# EAGLE schematic nRF9160 Thing Plus (EAGLE 9.6.2)
AUTHOR: Jared Wolff; BOARD_NUMBER: BRD-0016; COMPANY: Circuit Dojo; DOC_NUMBER: SCH-0016; DOC_REV: 1; PN: PS-NRF9160-THING-PLUS; TITLE: nRF9160 Thing Plus
Assembly variants: Production

## Sheet 1 of 3: Power + Headers
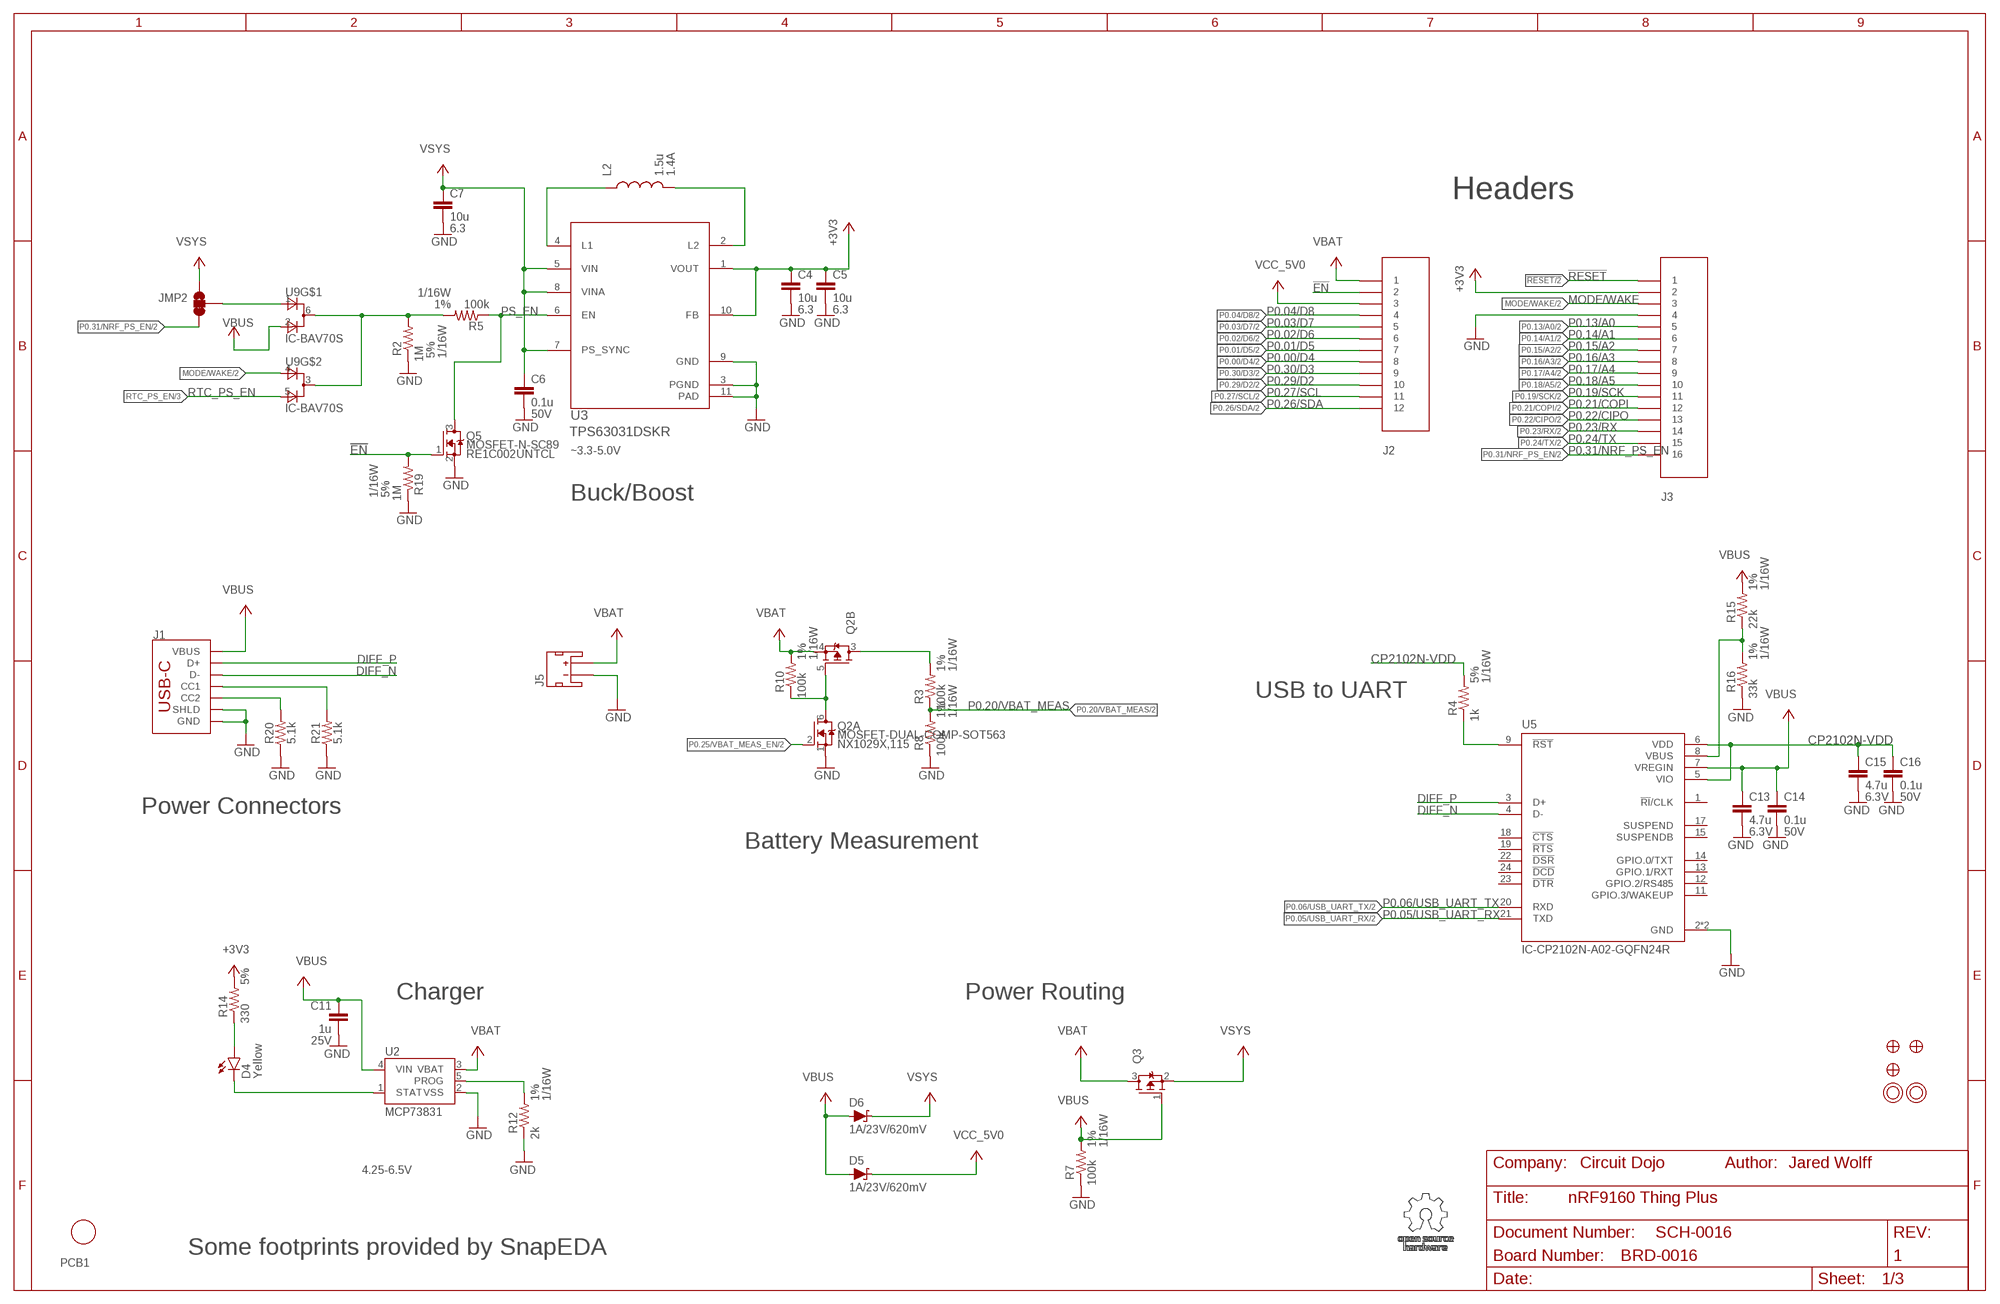
[diagram p0: schematic, sheet 1]

### Parts
C4  10u  CAP-10U-6.3V-0603  [C0603]
C5  10u  CAP-10U-6.3V-0603  [C0603]
C6  0.1u  CAP-0.1U-50V-0402  [CAPC1005X55N]
C7  10u  CAP-10U-6.3V-0603  [C0603]
C11  1u  CAP-1U-25V-1-0402  [CAPC1005X55N]
C13  4.7u  CAP-4.7U-6.3V-2-0603  [C0603]
C14  0.1u  CAP-0.1U-50V-0402  [CAPC1005X55N]
C15  4.7u  CAP-4.7U-6.3V-2-0603  [C0603]
C16  0.1u  CAP-0.1U-50V-0402  [CAPC1005X55N]
D4  Yellow  LED-YELLOW0603  [LED-0603]
D5  1A/23V/620mV  DIODE-SCHOTTKY-BAT20J  [SOD-323]
D6  1A/23V/620mV  DIODE-SCHOTTKY-BAT20J  [SOD-323]
J1  USB Female C  USB_C_2-LAYER_PADS  [USB-C-16P-2LAYER-PADS]
J2  CON-HEADER-1X12-MALE-PIN  [CON-HEADER-1X12-MALE-PIN]  (not fitted in variant Production)
J3  CON-HEADER-1X16-MALE-PIN  [CON-HEADER-1X16-MALE-PIN]  (not fitted in variant Production)
J5  JST_2MM_MALE  [JST-2-SMD]
JMP2  JUMPER-3/1  [JUMPER-ROUND-3-NO-R]
L2  1.5u  IND-1.5U-1.4A-2X2  [IND-2P0X2P0X1P2]
PCB1  PCB-NRF91-FEATHER  [PLACEHOLDER]
Q2  MOSFET-DUAL-COMP-SOT563  [SOT50P160X60-6N]
Q3  MOSFET-P-20V-4.7A-SOT23  [SOT23]
Q5  MOSFET-N-SC89  [DIO_RB558WMF-L]
R2  1M  RES-1M-5%-0402  [R0402-M]
R3  100k  RES-100K-1%-0402  [R0402-M]
R4  1k  RES-1K-5%-0402  [R0402-M]
R5  100k  RES-100K-1%-0402  [R0402-M]
R7  100k  RES-100K-1%-0402  [R0402-M]
R8  100k  RES-100K-1%-0402  [R0402-M]
R10  100k  RES-100K-1%-0402  [R0402-M]
R12  2k  RES-2K-1%-0402  [R0402-M]
R14  330  RES-330-5%-0402  [R0402-M]
R15  22k  RES-22K-1%-0402  [R0402-M]
R16  33k  RES-33K-1%-0402  [R0402-M]
R19  1M  RES-1M-5%-0402  [R0402-M]
R20  5.1k  5.1KOHM-0402T-1/16W-1%  [0402-TIGHT]
R21  5.1k  5.1KOHM-0402T-1/16W-1%  [0402-TIGHT]
U2  MCP73831  [SOT23-5]
U3  IC-TPS63031DSKR  [DSK0010A]
U5  IC-CP2102N-A02-GQFN24R  [QFN50P400X400X80-25N]
U9  IC-BAV70S  [SOT363]
U$3  FIDUCIAL-1MM  [FIDUCIAL-1MM]  (not fitted in variant Production)
U$4  FIDUCIAL-1MM  [FIDUCIAL-1MM]  (not fitted in variant Production)
U$31  MOUNTING-HOLE-2.5MM-PLATED  [MOUNTING-HOLE-2.5MM-PLATED]  (not fitted in variant Production)
U$32  MOUNTING-HOLE-2.5MM-PLATED  [MOUNTING-HOLE-2.5MM-PLATED]  (not fitted in variant Production)
U$35  FIDUCIAL-1MM  [FIDUCIAL-1MM]  (not fitted in variant Production)

### Nets
!EN: J2.2 Q5.1(G) R19.2
!RESET: J3.1 ; also sheet 2
+3V3: C4.1 C5.1 J3.2 R14.2 U3.1(VOUT) U3.10(FB) ; also sheet 2,3
CHRG: D4.C U2.1(STAT)
CP212_VBUS: R15.1 R16.2 U5.8(VBUS)
CP2102N-!RST: R4.1 U5.9(!RST)
CP2102N-VDD: C15.1 C16.1 R4.2 U5.5(VIO) U5.6(VDD)
DIFF_N [usb]: J1.A7(D-) J1.B7(D-) U5.4(D-)
DIFF_P [usb]: J1.A6(D+) J1.B6(D+) U5.3(D+)
GND: C4.2 C5.2 C6.2 C7.2 C11.2 C13.2 C14.2 C15.2 C16.2 J1.GND J1.GND2(GND) J1.SHLD1(SHLD) J1.SHLD2(SHLD) J1.SHLD3(SHLD) J1.SHLD4(SHLD) J3.4 J5.1(-) Q2.1(A:S) Q5.2(S) R2.1 R7.1 R8.1 R12.1 R16.1 R19.1 R20.1 R21.1 U2.2(VSS) U3.3(PGND) U3.9(GND) U3.11(PAD) U5.2(GND) U5.25(GND) ; also sheet 2,3
MODE/WAKE: J3.3 U9.4(A1) ; also sheet 2
N$1: L2.P$1 U3.4(L1)
N$2: L2.P$2 U3.2(L2)
N$3: J1.A5(CC1) R21.2
N$6: Q2.3(B:D) R3.2
N$7: Q2.5(B:G) Q2.6(A:D) R10.1
N$9: J1.B5(CC2) R20.2
N$13: D4.A R14.1
NRF_PS_EN_JMP: JMP2.P$2 U9.1(A1)
P0.00/D4: J2.8 ; also sheet 2
P0.01/D5: J2.7 ; also sheet 2
P0.02/D6: J2.6 ; also sheet 2
P0.03/D7: J2.5 ; also sheet 2
P0.04/D8: J2.4 ; also sheet 2
P0.05/USB_UART_RX: U5.21(TXD) ; also sheet 2
P0.06/USB_UART_TX: U5.20(RXD) ; also sheet 2
P0.13/A0: J3.5 ; also sheet 2
P0.14/A1: J3.6 ; also sheet 2
P0.15/A2: J3.7 ; also sheet 2
P0.16/A3: J3.8 ; also sheet 2
P0.17/A4: J3.9 ; also sheet 2
P0.18/A5: J3.10 ; also sheet 2
P0.19/SCK: J3.11 ; also sheet 2
P0.20/VBAT_MEAS: R3.1 R8.2 ; also sheet 2
P0.21/COPI: J3.12 ; also sheet 2
P0.22/CIPO: J3.13 ; also sheet 2
P0.23/RX: J3.14 ; also sheet 2
P0.24/TX: J3.15 ; also sheet 2
P0.25/VBAT_MEAS_EN: Q2.2(A:G) ; also sheet 2
P0.26/SDA: J2.12 ; also sheet 2,3
P0.27/SCL: J2.11 ; also sheet 2,3
P0.29/D2: J2.10 ; also sheet 2,3
P0.30/D3: J2.9 ; also sheet 2
P0.31/NRF_PS_EN: J3.16 JMP2.P$3 ; also sheet 2
PROG: R12.2 U2.5(PROG)
PS_EN: Q5.3(D) R5.1 U3.6(EN)
PS_EN_CC: R2.2 R5.2 U9.3(C) U9.6(C)
RTC_PS_EN: U9.5(A2) ; also sheet 3
VBAT: J2.1 J5.2(+) Q2.4(B:S) Q3.3(D) R10.2 U2.3(VBAT)
VBUS: C11.1 C13.1 C14.1 D5.A D6.A J1.VBUS1(VBUS) J1.VBUS2(VBUS) Q3.1(G) R7.2 R15.2 U2.4(VIN) U5.7(VREGIN) U9.2(A2)
VCC_5V0: D5.C J2.3
VSYS: C6.1 C7.1 D6.C JMP2.P$1 Q3.2(S) U3.5(VIN) U3.7(PS_SYNC) U3.8(VINA) ; also sheet 2,3
Unconnected: J5.NC1(PAD1) J5.NC2(PAD2) U5.1(!RI!/CLK) U5.11(GPIO.3/WAKEUP) U5.12(GPIO.2/RS485) U5.13(GPIO.1/RXT) U5.14(GPIO.0/TXT) U5.15(SUSPENDB) U5.17(SUSPEND) U5.18(!CTS) U5.19(!RTS) U5.22(!DSR) U5.23(!DTR) U5.24(!DCD)

### Notes on the sheet
- Headers
- ~3.3-5.0V
- Buck/Boost
- USB to UART
- Power Connectors
- Battery Measurement
- Charger | Power Routing
- 4.25-6.5V
- Some footprints provided by SnapEDA

## Sheet 2 of 3: Processor
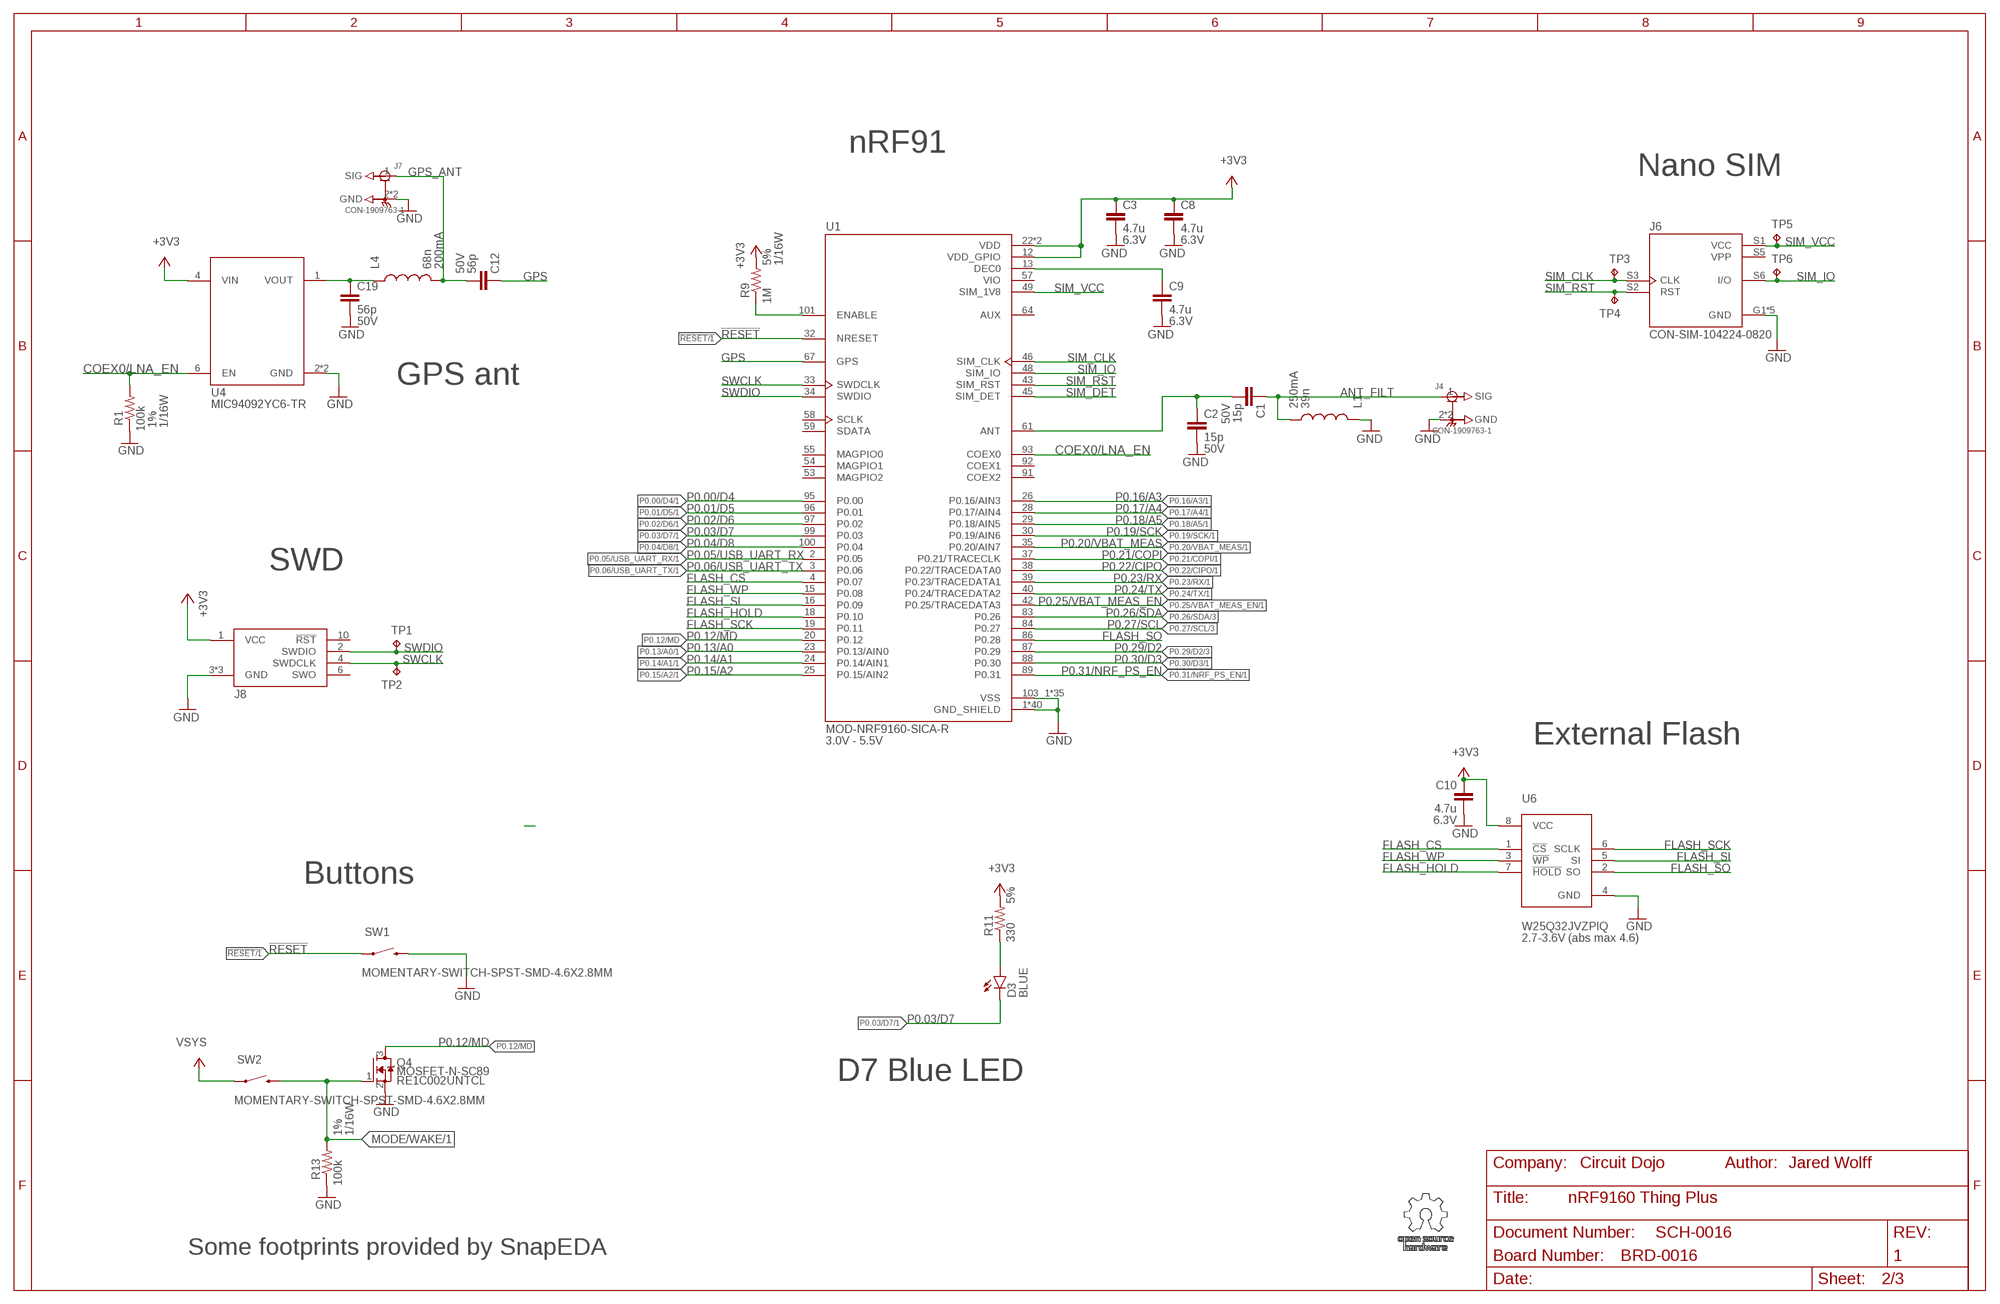
[diagram p1: schematic, sheet 2]

### Parts
C1  15p  CAP-15P-50V-0402  [CAPC1005X55N]
C2  15p  CAP-15P-50V-0402  [CAPC1005X55N]  (not fitted in variant Production)
C3  4.7u  CAP-4.7U-6.3V-2-0603  [C0603]
C8  4.7u  CAP-4.7U-6.3V-2-0603  [C0603]
C9  4.7u  CAP-4.7U-6.3V-2-0603  [C0603]
C10  4.7u  CAP-4.7U-6.3V-2-0603  [C0603]
C12  56p  CAP-56PF-50V-0402  [CAPC1005X55N]
C19  56p  CAP-56PF-50V-0402  [CAPC1005X55N]
D3  BLUE  LED-BLUE0603  [LED-0603]
J4  CON-1909763-1  [TE_1909763-1]
J6  CON-SIM-104224-0820  [MOLEX_104224-0820]
J7  CON-1909763-1  [TE_1909763-1]
J8  CON-FTSH-105-XX-X-DV  [SAMTEC_FTSH-105-XX-X-DV]
L1  39n  IND-39NH-250MA-0402  [IND0402_22N_TAI]
L4  68n  IND-68NH-200MA-0402  [IND0402_22N_TAI]
Q4  MOSFET-N-SC89  [DIO_RB558WMF-L]
R1  100k  RES-100K-1%-0402  [R0402-M]
R9  1M  RES-1M-5%-0402  [R0402-M]
R11  330  RES-330-5%-0402  [R0402-M]
R13  100k  RES-100K-1%-0402  [R0402-M]
SW1  MOMENTARY-SWITCH-SPST-SMD-4.6X2.8MM  [TACTILE_SWITCH_SMD_4.6X2.8MM]
SW2  MOMENTARY-SWITCH-SPST-SMD-4.6X2.8MM  [TACTILE_SWITCH_SMD_4.6X2.8MM]
TP1  TP-1SIDE-1P0  [TP-1P0]
TP2  TP-1SIDE-1P0  [TP-1P0]
TP3  TP-1SIDE-1P0  [TP-1P0]
TP4  TP-1SIDE-1P0  [TP-1P0]
TP5  TP-1SIDE-1P0  [TP-1P0]
TP6  TP-1SIDE-1P0  [TP-1P0]
U1  MOD-NRF9160-SICA-R  [NORDIC_NRF9160-SICA-R]
U4  POWER-SWITCH-MIC94092YC6  [SOT363]
U6  FLASH-WSON  FLASH-W25Q32JVZPIQ-WSON  [WIN_ZP-8-L]

### Nets
!RESET: SW1.1 SW1.2 U1.32(NRESET) ; also sheet 1
+3V3: C3.1 C8.1 C10.1 J8.1(VCC) R9.2 R11.2 U1.12(VDD_GPIO) U1.22(VDD) U1.102(VDD) U4.4(VIN) U6.8(VCC) ; also sheet 1,3
ANT [rf]: C1.2 C2.1 U1.61(ANT)
ANT_FILT [rf]: C1.1 J4.1(SIG) L1.2
COEX0/LNA_EN: R1.2 U1.93(COEX0) U4.6(EN)
FLASH_CS: U1.4(P0.07) U6.1(!CS)
FLASH_HOLD: U1.18(P0.10) U6.7(!HOLD)
FLASH_SCK: U1.19(P0.11) U6.6(SCLK)
FLASH_SI: U1.16(P0.09) U6.5(SI)
FLASH_SO: U1.86(P0.28) U6.2(SO)
FLASH_WP: U1.15(P0.08) U6.3(!WP)
GND: C2.2 C3.2 C8.2 C9.2 C10.2 C19.2 J4.2(GND) J4.3(GND) J6.G1(GND) J6.G2(GND) J6.G3(GND) J6.G4(GND) J6.S4(GND) J7.2(GND) J7.3(GND) J8.3(GND) J8.5(GND) J8.9(GND) L1.1 Q4.2(S) R1.1 R13.1 SW1.3 SW1.4 U1.1(GND_SHIELD) U1.5(GND_SHIELD) U1.6(GND_SHIELD) U1.7(GND_SHIELD) U1.8(GND_SHIELD) U1.9(GND_SHIELD) U1.11(GND_SHIELD) U1.14(GND_SHIELD) U1.17(GND_SHIELD) U1.21(GND_SHIELD) U1.27(GND_SHIELD) U1.31(GND_SHIELD) U1.36(GND_SHIELD) U1.41(GND_SHIELD) U1.44(GND_SHIELD) U1.47(GND_SHIELD) U1.50(GND_SHIELD) U1.52(GND_SHIELD) U1.56(GND_SHIELD) U1.60(GND_SHIELD) U1.62(GND_SHIELD) U1.63(GND_SHIELD) U1.65(GND_SHIELD) U1.66(GND_SHIELD) U1.68(GND_SHIELD) U1.69(GND_SHIELD) U1.72(GND_SHIELD) U1.74(GND_SHIELD) U1.75(GND_SHIELD) U1.76(GND_SHIELD) U1.77(GND_SHIELD) U1.78(GND_SHIELD) U1.79(GND_SHIELD) U1.80(GND_SHIELD) U1.81(GND_SHIELD) U1.82(GND_SHIELD) U1.85(GND_SHIELD) U1.90(GND_SHIELD) U1.94(GND_SHIELD) U1.98(GND_SHIELD) U1.103_1(VSS) U1.103_2(VSS) U1.103_3(VSS) U1.103_4(VSS) U1.103_5(VSS) U1.103_6(VSS) U1.103_7(VSS) U1.103_8(VSS) U1.103_9(VSS) U1.103_10(VSS) U1.103_11(VSS) U1.103_12(VSS) U1.103_13(VSS) U1.103_14(VSS) U1.103_15(VSS) U1.103_16(VSS) U1.103_17(VSS) U1.103_18(VSS) U1.103_19(VSS) U1.103_20(VSS) U1.103_21(VSS) U1.103_22(VSS) U1.103_23(VSS) U1.103_24(VSS) U1.103_25(VSS) U1.103_26(VSS) U1.103_27(VSS) U1.103_28(VSS) U1.103_29(VSS) U1.103_30(VSS) U1.103_31(VSS) U1.103_32(VSS) U1.103_33(VSS) U1.103_34(VSS) U1.103_35(VSS) U4.2(GND) U4.5(GND) U6.4(GND) ; also sheet 1,3
GPS [rf]: C12.1 U1.67(GPS)
GPS_ANT [rf]: C12.2 J7.1(SIG) L4.2
LNA_SW_OUT: C19.1 L4.1 U4.1(VOUT)
MODE/WAKE: Q4.1(G) R13.2 SW2.3 SW2.4 ; also sheet 1
N$4: R9.1 U1.101(ENABLE)
N$5: C9.1 U1.13(DEC0)
N$8: D3.A R11.1
P0.00/D4: U1.95(P0.00) ; also sheet 1
P0.01/D5: U1.96(P0.01) ; also sheet 1
P0.02/D6: U1.97(P0.02) ; also sheet 1
P0.03/D7: D3.C U1.99(P0.03) ; also sheet 1
P0.04/D8: U1.100(P0.04) ; also sheet 1
P0.05/USB_UART_RX: U1.2(P0.05) ; also sheet 1
P0.06/USB_UART_TX: U1.3(P0.06) ; also sheet 1
P0.12/MD: Q4.3(D) U1.20(P0.12)
P0.13/A0: U1.23(P0.13/AIN0) ; also sheet 1
P0.14/A1: U1.24(P0.14/AIN1) ; also sheet 1
P0.15/A2: U1.25(P0.15/AIN2) ; also sheet 1
P0.16/A3: U1.26(P0.16/AIN3) ; also sheet 1
P0.17/A4: U1.28(P0.17/AIN4) ; also sheet 1
P0.18/A5: U1.29(P0.18/AIN5) ; also sheet 1
P0.19/SCK: U1.30(P0.19/AIN6) ; also sheet 1
P0.20/VBAT_MEAS: U1.35(P0.20/AIN7) ; also sheet 1
P0.21/COPI: U1.37(P0.21/TRACECLK) ; also sheet 1
P0.22/CIPO: U1.38(P0.22/TRACEDATA0) ; also sheet 1
P0.23/RX: U1.39(P0.23/TRACEDATA1) ; also sheet 1
P0.24/TX: U1.40(P0.24/TRACEDATA2) ; also sheet 1
P0.25/VBAT_MEAS_EN: U1.42(P0.25/TRACEDATA3) ; also sheet 1
P0.26/SDA: U1.83(P0.26) ; also sheet 1,3
P0.27/SCL: U1.84(P0.27) ; also sheet 1,3
P0.29/D2: U1.87(P0.29) ; also sheet 1,3
P0.30/D3: U1.88(P0.30) ; also sheet 1
P0.31/NRF_PS_EN: U1.89(P0.31) ; also sheet 1
SIM_CLK: J6.S3(CLK) TP3.TP U1.46(SIM_CLK)
SIM_DET: U1.45(SIM_DET)
SIM_IO: J6.S6(I/O) TP6.TP U1.48(SIM_IO)
SIM_RST: J6.S2(RST) TP4.TP U1.43(SIM_RST)
SIM_VCC: J6.S1(VCC) TP5.TP U1.49(SIM_1V8)
SWCLK: J8.4(SWDCLK) TP2.TP U1.33(SWDCLK)
SWDIO: J8.2(SWDIO) TP1.TP U1.34(SWDIO)
VSYS: SW2.1 SW2.2 ; also sheet 1,3
Unconnected: J8.6(SWO) J8.10(!RST) U1.53(MAGPIO2) U1.54(MAGPIO1) U1.55(MAGPIO0) U1.58(SCLK) U1.59(SDATA) U1.64(AUX) U1.91(COEX2) U1.92(COEX1)

### Notes on the sheet
- nRF91
- Nano SIM
- GPS ant
- SWD
- 3.0V - 5.5V | External Flash
- Buttons
- 2.7-3.6V (abs max 4.6)
- D7 Blue LED
- Some footprints provided by SnapEDA

## Sheet 3 of 3: Wakeup Source & Qwiic
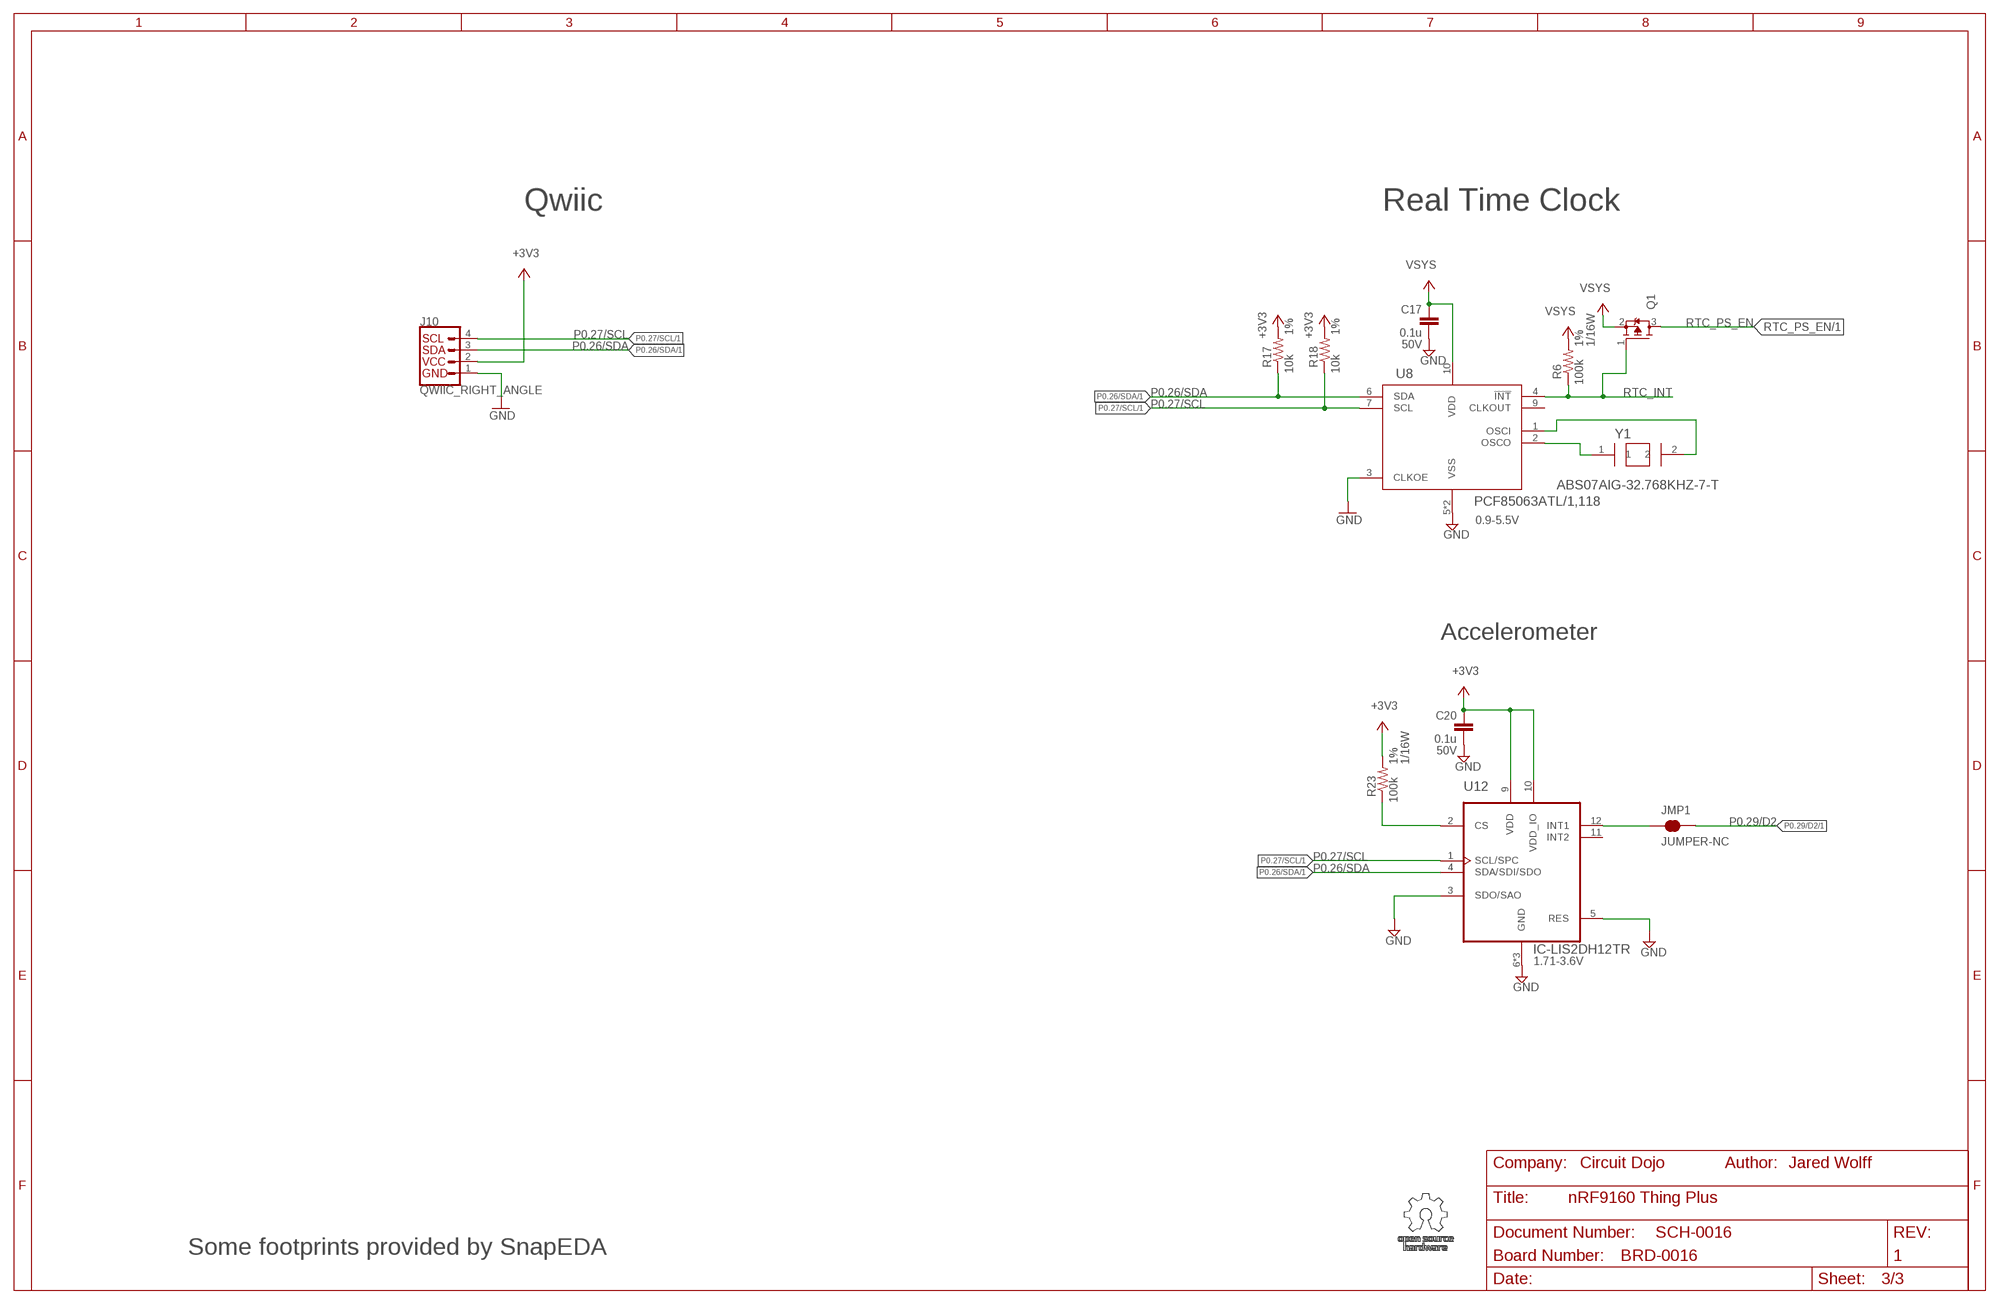
[diagram p2: schematic, sheet 3]

### Parts
C17  0.1u  CAP-0.1U-50V-0402  [CAPC1005X55N]
C20  0.1u  CAP-0.1U-50V-0402  [CAPC1005X55N]
J10  QWIIC_RIGHT_ANGLE  QWIIC_CONNECTORJS-1MM  [JST04_1MM_RA]
JMP1  JUMPER-NC  [JUMPER-ROUND-NC]
Q1  MOSFET-P-SC89  [DIO_RB558WMF-L]
R6  100k  RES-100K-1%-0402  [R0402-M]
R17  10k  RES-10K-1%-0402  [R0402-M]
R18  10k  RES-10K-1%-0402  [R0402-M]
R23  100k  RES-100K-1%-0402  [R0402-M]
U8  IC-PCF85063ATL/1  [DFN10_2P7X2P7-L]
U12  IC-LIS2DH12TR  [PQFN50P200X200100-12N]
Y1  XTAL-ABS07AIG-32.768KHZ-7-T  [XTAL320X150X90]

### Nets
+3V3: C20.1 J10.2 R17.2 R18.2 R23.2 U12.9(VDD) U12.10(VDD_IO) ; also sheet 1,2
GND: C17.2 C20.2 J10.1 U8.3(CLKOE) U8.5(VSS) U8.11(VSS) U12.3(SDO/SAO) U12.5(RES) U12.6(GND) U12.7(GND) U12.8(GND) ; also sheet 1,2
N$10: U8.1(OSCI) Y1.2
N$11: R23.1 U12.2(CS)
N$12: JMP1.P$1 U12.12(INT1)
N$18: U8.2(OSCO) Y1.1
P0.26/SDA: J10.3 R17.1 U8.6(SDA) U12.4(SDA/SDI/SDO) ; also sheet 1,2
P0.27/SCL: J10.4 R18.1 U8.7(SCL) U12.1(SCL/SPC) ; also sheet 1,2
P0.29/D2: JMP1.P$2 ; also sheet 1,2
RTC_INT: Q1.1(G) R6.1 U8.4(!INT)
RTC_PS_EN: Q1.3(D) ; also sheet 1
VSYS: C17.1 Q1.2(S) R6.2 U8.10(VDD) ; also sheet 1,2
Unconnected: U8.9(CLKOUT) U12.11(INT2)

### Notes on the sheet
- Qwiic | Real Time Clock
- 0.9-5.5V
- Accelerometer
- 1.71-3.6V
- Some footprints provided by SnapEDA

## Power pins joined to a net without a drawn wire
VIO: U1.57(VIO)
VPP: J6.S5(VPP)

## Library data of the parts
C1 C2 = nRF9160-Capacitors:CAP: CAPACITOR; DESC: CAP CER 15PF 50V C0G/NPO 0402; DIGIKEYPN: 311-1017-1-ND; MF: Yageo; MPN: CC0402JRNPO9BN150; PROD_ID: CAP-13063; VOLTHIGH: 50V
C3 C8-C10 C13 C15 = nRF9160-Capacitors:CAP: CAPACITOR; DESC: CAP CER 4.7UF 6.3V X7R 0603; DIGIKEYPN: 587-4906-1-ND; MPN: JMK107BB7475MA-T; PROD_ID: CAP-08280; TEMPHIGH: 125; TEMPLOW: -55; VOLTHIGH: 6.3V
C4 C5 C7 = nRF9160-Capacitors:CAP: CAPACITOR; DESC: CAP CER 10UF 6.3V X5R 0603; DIGIKEYPN: 587-5869-1-ND; MPN: JMK107ABJ106MA-T; PROD_ID: CAP-11015; VOLTHIGH: 6.3
C6 C14 C16 C17 C20 = nRF9160-Capacitors:CAP: CAPACITOR; DESC: CAP CER 0.1UF 50V X5R 0402; DIGIKEYPN: 587-3499-1-ND; MF: Taiyo Yuden; MPN: UMK105BJ104KV-F; PROD_ID: CAP-15083; VOLTHIGH: 50V
C11 = nRF9160-Capacitors:CAP: CAPACITOR; DESC: CAP CER 1UF 25V X5R 0402; DIGIKEYPN: 445-9081-1-ND; MF: TDK; MPN: C1005X5R1E105M050BC; PROD_ID: CAP-12417; VOLTHIGH: 25V
C12 C19 = nRF9160-Capacitors:CAP: CAPACITOR; DESC: CAP CER 56PF 50V C0G/NP0 0402; DIGIKEYPN: 399-1020-1-ND‎; MF: Kemet; MPN: C0402C560J5GACTU‎; PROD_ID: CAP-15409; VOLTHIGH: 50V
D3 = SparkFun-LED:LED-BLUE: Blue SMD LED Used in manufacturing of various products at SparkFun Packages: 0603 - SMD 0603 package [Product Link] <http://www.digikey.com/product-detail/en/SMLE12BC7TT86/511-1589-2-ND/1641808> 1206 - SMD1206 package [Product Link] <http://www.digikey.com/product-detail/en/lite-on-inc/LTST-C150TBKT/160-1643-1-ND/573584> SparkFun Products: ESP8266 Thing-Dev Board <https://www.sparkfun.com/products/13711> RedBoard <https://www.sparkfun.com/products/12757>; PROD_ID: DIO-08575
D4 = SparkFun-LED:LED-YELLOW: Yellow SMD LED Used in manufacturing several products at SparkFun. Packages: 0603 - SMD 0603 package[Product Link] <http://www.kingbrightusa.com/product.asp?catalog_name=LED&product_id=APT1608SYCK> 0603 -SMART - SMART SMD 0603 package (more efficient/more expensive) [Product Link] <http://www.osram-os.com/osram_os/en/products/product-catalog/led-light-emitting-diodes/smartled-0603/ly-l29k/index.jsp> LilyPad - SMD1206 package[Product Datasheet] <https://www.sparkfun.com/datasheets/DevTools/LilyPad/Q150YUS4.pdf> SparkFun Products: Blynk Board <https://www.sparkfun.com/products/13794> IOIO-OTG <https://www.sparkfun.com/products/13613> XBee Explorer Serial <https://www.sparkfun.com/products/13225>; PROD_ID: DIO-09003
D5 D6 = SparkFun-DiscreteSemi:DIODE-SCHOTTKY: Schottky diode A Schottky diode is a semiconductor diode which has a low forward voltage drop and a very fast switching action.; PROD_ID: DIO-11623
J1 = SparkFun-Connectors:USB_C: USB Type C 16Pin Connector Super Speed pins not available on the 16-pin purely SMD connector so this part is best for USB 2.0 implementations. D1 and D2 are tied together enabling D+/- no matter which way the cable is plugged into the connector. The two channel configuration pins (CC1/2) are exposed. These are normally connected to ground via 5.1k resistors but can be reconfigured for high current/high power applications.; PROD_ID: CONN-14122
J2 = wolff-den:CON-HEADER-1X12; ALIAS: POGO-1.9MM-S19-501
J3 = wolff-den:CON-HEADER-1X16
J4 J7 = nRF9160-Connectors:CON-1909763-1: VAO ITEM, MINI RF HEADER; DESC: CONN UMCC JACK STR 50OHM SMD; DIGIKEYPN: A118077CT-ND; MF: TE Connectivity; MPN: 1909763-1; PROD_ID: CONN-15410
J5 = SparkFun-Connectors:JST_2MM_MALE: JST 2MM MALE RA CONNECTOR Two pin, compact surface mount connector. Commonly used as a battery input connection point. We really like the solid locking feeling and high current rating on these small connectors. We use these all the time as battery connectors. Mates to single-cell LiPo batteries. Here is the connector we sell at SparkFun: JST Right Angle Connector - White <https://www.sparkfun.com/products/8612> (PRT-08612) Datasheet <http://www.sparkfun.com/datasheets/Prototyping/Connectors/JST-Horizontal.pdf> It was used on these SparkFun products: SparkFun MOSFET Power Controller <https://www.sparkfun.com/products/11214> (PRT-11214) SparkFun Battery Babysitter - LiPo Battery Manager <https://www.sparkfun.com/products/13777> (PRT-13777) And many, many others that required a lipo battery connection.; PROD_ID: CONN-11443; SF_ID: PRT-08612
J6 = wolff-den:CON-SIM: Conn SIM SKT 6 POS 2.54mm Solder RA SMD; DESC: NANOSIM SOCKET 1.11H P/PULL TYPE; DESCRIPTION: 6 Position Card Connector NANO SIM Surface Mount, Right Angle Gold; MF: Molex; MPN: 104224-0820; PACKAGE: None; PRICE: None
J8 = wolff-den:CON-FTSH-105-XX-X-DV: Connector Header Surface Mount 10 position 0.050" (1.27mm) Check prices <https://pricing.snapeda.com/parts/FTSH-105-01-F-DV-K/Samtec/view-part?ref=eda>; DESCRIPTION: Connector Header Surface Mount 10 position 0.050 (1.27mm); DIGIKEYPN: SAM8796-ND; MF: Samtec; MPN: FTSH-105-01-F-DV-K; PRICE: None; PURCHASE-URL: https://pricing.snapeda.com/search/part/FTSH-105-01-F-DV-K/?ref=eda
J10 = SparkFun-Connectors:QWIIC_CONNECTOR: SparkFun I2C Standard Qwiic Connector An SMD 1mm pitch JST connector makes it easy and quick (get it? Qwiic?) to connect I2C devices to each other. The Qwiic system <http://www.sparkfun.com/qwiic> enables fast and solderless connection between popular platforms and various sensors and actuators. We carry 200mm <https://www.sparkfun.com/products/14204>, 100mm <https://www.sparkfun.com/products/14205>, 50mm <https://www.sparkfun.com/products/14206>, and breadboard friendly <https://www.sparkfun.com/products/14207> Qwiic cables. We also offer 10 pcs strips <https://www.sparkfun.com/products/14323> the SMD connectors.; PROD_ID: CONN-13694
JMP1 = wolff-den:JUMPER-NC
JMP2 = wolff-den:JUMPER-3/1
L1 = nRF9160-Coils:IND: INDUCTOR; CURRENT: 250mA; DESC: FIXED IND 39NH 250MA 1.06 OHM; DIGIKEYPN: 490-1092-1-ND; MPN: LQG15HN39NJ02D; PROD_ID: NDUC-15408
L2 = nRF9160-Coils:IND-1.5U-1.4A-2X2: FIXED IND 1.5UH 1.4A 120 MOHM; CURRENT: 1.4A; DESC: FIXED IND 1.5UH 1.4A 120 MOHM; DIGIKEYPN: 587-4702-1-ND; MPN: NRV2012T1R5NGF; PROD_ID: NDUC-15405
L4 = nRF9160-Coils:IND: INDUCTOR; CURRENT: 200mA; DESC: FIXED IND 68NH 200MA 1.25 OHM; DIGIKEYPN: ‎490-15092-1-ND‎; MPN: LQG15HN68NH02D‎; PROD_ID: NDUC-15356
PCB1 = wolff-den:PCB; MPN: BRD-0015
Q1 = nRF9160-DiscreteSemi:MOSFET-P: MOSFET P-CH; DESC: MOSFET P-CH 20V 0.1A EMT3; DIGIKEYPN: RE1C001ZPTLCT-ND; MPN: RE1C001ZPTL; PROD_ID: TRANS-15421
Q2 = nRF9160-DiscreteSemi:MOSFET-DUAL-COMP; DESC: MOSFET N/P-CH 60V/50V SOT666; DIGIKEYPN: 1727-1277-1-ND; MPN: NX1029X,115; PROD_ID: IC-15419
Q3 = nRF9160-DiscreteSemi:MOSFET-P: MOSFET P-CH; DESC: MOSFET P-CHANNEL 20V 4.7A SOT23; DIGIKEYPN: TSM500P02CXRFGCT-ND; MPN: TSM500P02CX RFG; PROD_ID: TRANS-14388
Q4 Q5 = nRF9160-DiscreteSemi:MOSFET-N; DESC: MOSFET N-CH 20V 0.2A EMT3; DIGIKEYPN: RE1C002UNTCLCT-ND; MF: Rohm Semiconductor; MPN: RE1C002UNTCL; PROD_ID: TRANS-15420
R1 R3 R5-R8 R10 R13 R23 = nRF9160-Resistors:RES: RESISTOR; DESC: RES SMD 100K OHM 1% 1/16W 0402; DIGIKEYPN: 311-100KLRCT-ND; MPN: RC0402FR07100KL; POWER: 1/16W; PROD_ID: RES-13495; TOLERANCE: 1%
R2 R9 R19 = nRF9160-Resistors:RES: RESISTOR; DESC: RES SMD 1M OHM 5% 1/16W 0402; DIGIKEYPN: 311-1.0MJRCT-ND; MPN: RC0402JR-071ML; POWER: 1/16W; PROD_ID: RES-15185; TOLERANCE: 5%
R4 = nRF9160-Resistors:RES: RESISTOR; DESC: RES SMD 1K OHM 5% 1/16W 0402; DIGIKEYPN: 311-1.0KJRCT-ND; MPN: RC0402JR-071KL; POWER: 1/16W; PROD_ID: RES-14342; TOLERANCE: 5%
R11 R14 = nRF9160-Resistors:RES: RESISTOR; DESC: RES SMD 330 OHM 5% 1/16W 0402; DIGIKEYPN: 311-330JRCT-ND; MF: Yageo; MPN: RC0402JR-07330RL; PROD_ID: RES-15407; TOLERANCE: 5%
R12 = nRF9160-Resistors:RES: RESISTOR; DESC: RES SMD 2K OHM 1% 1/16W 0402; DIGIKEYPN: 311-2KLRCT-ND; MPN: RC0402FR-072KL; POWER: 1/16W; PROD_ID: RES-15406; TOLERANCE: 1%
R15 = nRF9160-Resistors:RES: RESISTOR; DESC: RES SMD 22K OHM 1% 1/16W 0402; DIGIKEYPN: 311-22.0KLRCT-ND; MF: Yageo; MPN: RC0402FR-0722KL; POWER: 1/16W; PROD_ID: RES-14281; TOLERANCE: 1%
R16 = nRF9160-Resistors:RES: RESISTOR; DESC: RES SMD 33K OHM 1% 1/16W 0402; DIGIKEYPN: 311-33.0KLRCT-ND; MF: Yageo; MPN: RC0402FR-0722KL; POWER: 1/16W; PROD_ID: RES-15128; TOLERANCE: 1%
R17 R18 = nRF9160-Resistors:RES: RESISTOR; DIGIKEYPN: 311-10.0KHRCT-ND; MPN: RC0603FR-0710KL; PROD_ID: RES-14241; TEMPHIGH: 155; TEMPLOW: -55; TOLERANCE: 1%
R20 R21 = SparkFun-Resistors:5.1KOHM; PROD_ID: RES-14340
SW1 SW2 = SparkFun-Switches:MOMENTARY-SWITCH-SPST: Momentary Switch (Pushbutton) - SPST Normally-open (NO) SPST momentary switches (buttons, pushbuttons). Variants PTH-12MM - 12mm square, through-hole Momentary Pushbutton Switch - 12mm Square <https://www.sparkfun.com/products/9190> (COM-09190) PTH-6.0MM, PTH-6.0MM-KIT - 6.0mm square, through-hole Mini Pushbutton Switch <https://www.sparkfun.com/products/97> (COM-00097) KIT package intended for soldering kit's - only one side of pads' copper is exposed. PTH-RIGHT-ANGLE-KIT - Right-angle, through-hole Right Angle Tactile Button <https://www.sparkfun.com/products/10791> - Used on SparkFun BigTime Watch Kit <https://www.sparkfun.com/products/11734> SMD-12MM - 12mm square, surface-mount Tactile Button - SMD (12mm) <https://www.sparkfun.com/products/12993> (COM-12993) Used on SparkFun PicoBoard <https://www.sparkfun.com/products/11888> SMD-4.5MM - 4.5mm Square Trackball Switch Used on SparkFun Blackberry Trackballer Breakout <https://www.sparkfun.com/products/13169> SMD-4.6MMX2.8MM - 4.60mm x 2.80mm, surface mount Used on SparkFun SAMD21 Mini Breakout <https://www.sparkfun.com/products/13664> SMD-5.2MM, SMD-5.2-REDUNDANT - 5.2mm square, surface-mount Mini Pushbutton Switch - SMD <https://www.sparkfun.com/products/8720> (COM-08720) Used on Arduino Pro Mini <https://www.sparkfun.com/products/11114> REDUNDANT package connects both switch circuits together SMD-6.0X3.5MM - 6.0 x 3.5mm, surface mount Momentary Reset Switch SMD <https://www.sparkfun.com/products/8229> (COM-08229) SMD-6.2MM-TALL - 6.2mm square, surface mount Tactile Button - SMD (6mm) <https://www.sparkfun.com/products/12992> Used on SparkFun Digital Sandbox <https://www.sparkfun.com/products/12651> SMD-RIGHT-ANGLE - Right-angle, surface mount Used on SparkFun Block for Intel® Edison - Arduino <https://www.sparkfun.com/products/13036>; PROD_ID: SWCH-13065
TP1-TP6 = wolff-den:TP: TEST POINT
U1 = nRF9160-IC:MOD-NRF9160-SICA-R: NRF9160-SICA-R; DESC: IC RF TXRX+MCU CELL LTE-M/NB-IOT; DIGIKEYPN: 1490-1076-1-ND; MF: Nordic Semiconductor; MPN: NRF9160-SICA-R; PROD_ID: IC-15418
U2 = SparkFun-IC-Power:MCP73831: MCP73831T Li-Ion, Li-Pol Controller Miniature single cell, fully integrated Li-Ion, Li-polymer charge management controller Datasheet <http://ww1.microchip.com/downloads/en/DeviceDoc/20001984g.pdf> SparkFun Products: SparkFun ESP32 Thing <https://www.sparkfun.com/products/13907> SparkFun 9DoF Razor IMU M0 <https://www.sparkfun.com/products/14001>; PROD_ID: IC-09995
U3 = nRF9160-IC:IC-TPS6303; DESC: IC REG BCK BST 3.3V 900MA 10SON; DIGIKEYPN: 296-39461-1-ND; MF: Texas Instruments; MPN: TPS63031DSKR; PROD_ID: IC-15417
U4 = nRF9160-IC:POWER-SWITCH: IC SWITCH; DESC: IC LOAD SW HGH SIDE 1.2A SC70-6; DIGIKEYPN: 576-3488-1-ND; MPN: MIC94092YC6-TR; PROD_ID: IC-15422
U5 = nRF9160-IC:IC-CP2102N-A02-GQFN24R: Check prices <https://snapeda.com/parts/CP2102N-A02-GQFN24R/Silicon%20Labs/view-part/?ref=eda>; DESC: USB Bridge, USB to UART USB 2.0 UART Interface 24-QFN (4x4); DIGIKEYPN: 336-5888-1-ND; MF: Silicon Labs; MPN: CP2102N-A02-GQFN24R; PROD_ID: IC-14020
U6 = wolff-den:FLASH: NOR FLASH; DESC: IC FLASH 32M SPI 133MHZ 8WSON; DIGIKEYPN: W25Q32JVZPIQ-ND; MPN: W25Q32JVZPIQ
U8 = nRF9160-IC:IC-PCF85063ATL/1; DESC: IC RTC CLK/CALENDAR I2C 10-SON; DIGIKEYPN: 568-10235-1-ND; MF: NXP; MPN: PCF85063ATL/1,118; PROD_ID: IC-15415
U9 = nRF9160-DiscreteSemi:IC-BAV70S; DESC: DIODE ARRAY GP 100V 250MA 6TSSOP; DIGIKEYPN: 1727-4310-1-ND; MF: Nexperia USA Inc.; MPN: BAV70S,115; PROD_ID: DIO-15412
U12 = nRF9160-IC:IC-LIS2DH12TR: ACCEL 2-16G I2C/SPI 12LGA; AVAILABILITY: Good; DESCRIPTION: MEMS digital output motion sensor: ultra low-power high performance 3-axes femto accelerometer; DIGIKEYPN: 497-14851-1-ND; MF: STMicroelectronics; MPN: LIS2DH12TR; PACKAGE: LGA-12 STMicroelectronics; PRICE: 0.85 USD; PROD_ID: IC-14229; VOLTHIGH: 3.6; VOLTLOW: 1.71
U$3 U$4 U$35 = wolff-den:FIDUCIAL
U$31 U$32 = wolff-den:MOUNTING-HOLE
Y1 = nRF9160-Clocks:XTAL-ABS07AIG-32.768KHZ-7-T: ABS07 Series 32.768 kHz ±20 ppm 12.5 pF -40 to +85 C SMT Low Profile Crystal; DESC: CRYSTAL 32.768KHZ 7PF SMD; DIGIKEYPN: 535-13350-1-ND; MF: Abracon; MPN: ABS07AIG-32.768KHZ-7-T; PROD_ID: XTAL-13062

## Net classes
1 usb: width 0.15 mm
2 rf: width 0.3 mm